# Altium schematic sheet RS485_RS232.SchDoc
size A4; SheetNumber: 2; SheetTotal: 5
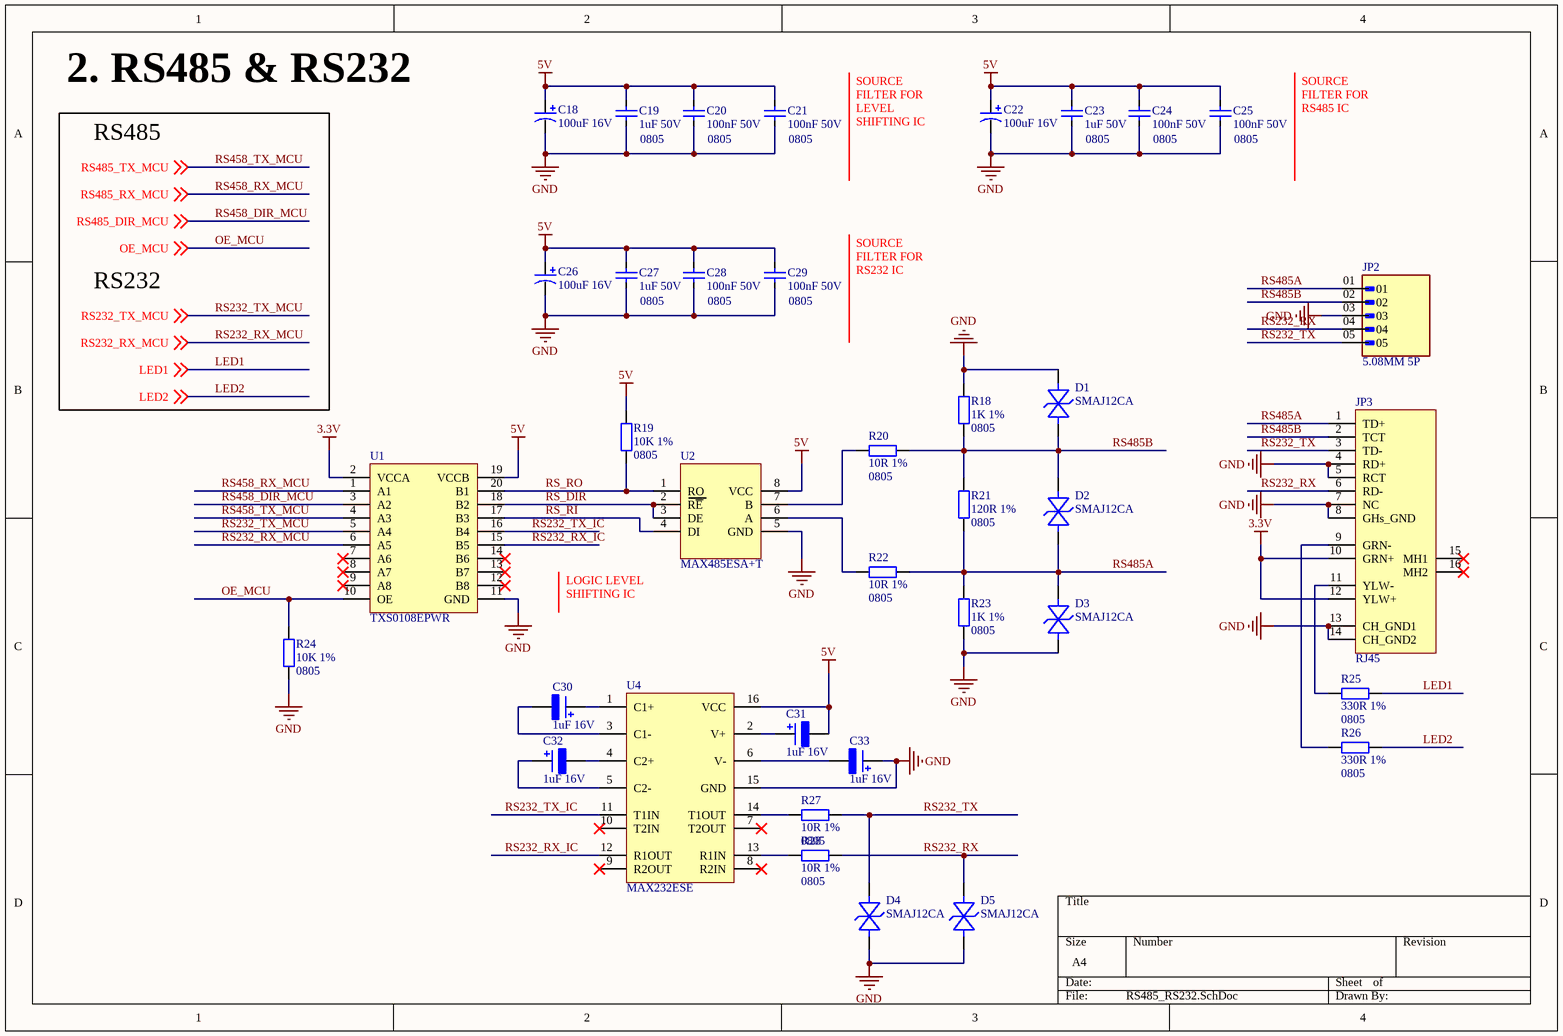
[diagram p0: RS485_RS232.SchDoc]

## Parts
C18  100uF 16V  [CAP-ALU-SMD-D]
C19  1uF 50V  Size: 0805  [CAP_SMD_0805]
C20  100nF 50V  Size: 0805  [CAP_SMD_0805]
C21  100nF 50V  Size: 0805  [CAP_SMD_0805]
C22  100uF 16V  [CAP-ALU-SMD-D]
C23  1uF 50V  Size: 0805  [CAP_SMD_0805]
C24  100nF 50V  Size: 0805  [CAP_SMD_0805]
C25  100nF 50V  Size: 0805  [CAP_SMD_0805]
C26  100uF 16V  [CAP-ALU-SMD-D]
C27  1uF 50V  Size: 0805  [CAP_SMD_0805]
C28  100nF 50V  Size: 0805  [CAP_SMD_0805]
C29  100nF 50V  Size: 0805  [CAP_SMD_0805]
C30  1uF 16V  [TANTALUM_3216]
C31  1uF 16V  [TANTALUM_3216]
C32  1uF 16V  [TANTALUM_3216]
C33  1uF 16V  [TANTALUM_3216]
D1  SMAJ12CA  [SMA]
D2  SMAJ12CA  [SMA]
D3  SMAJ12CA  [SMA]
D4  SMAJ12CA  [SMA]
D5  SMAJ12CA  [SMA]
JP2  5.08MM 5P  [5.08MM 5P]
JP3  RJ45  [RJ 45]
R18  1K 1%  Size: 0805  [RES_SMD_0805]
R19  10K 1%  Size: 0805  [RES_SMD_0805]
R20  10R 1%  Size: 0805  [RES_SMD_0805]
R21  120R 1%  Size: 0805  [RES_SMD_0805]
R22  10R 1%  Size: 0805  [RES_SMD_0805]
R23  1K 1%  Size: 0805  [RES_SMD_0805]
R24  10K 1%  Size: 0805  [RES_SMD_0805]
R25  330R 1%  Size: 0805  [RES_SMD_0805]
R26  330R 1%  Size: 0805  [RES_SMD_0805]
R27  10R 1%  Size: 0805  [RES_SMD_0805]
R28  10R 1%  Size: 0805  [RES_SMD_0805]
U1  TXS0108EPWR  [20-TSSOP]
U2  MAX485ESA+T  [SOIC-8]
U4  MAX232ESE  [SOP-16]

## Nets
3.3V: JP3.10(GRN+) JP3.12(YLW+) U1.2(VCCA)
5V: C18.1 C19.1 C20.2 C21.2 C22.1 C23.1 C24.2 C25.2 C26.1 C27.1 C28.2 C29.2 C31.2 R19.2 U1.19(VCCB) U2.8(VCC) U4.16(VCC)
GND: C18.2 C19.2 C20.1 C21.1 C22.2 C23.2 C24.1 C25.1 C26.2 C27.2 C28.1 C29.1 C33.1 D1.A D3.C D4.C D5.C JP2.03 JP3.4(RD+) JP3.5(RCT) JP3.7(NC) JP3.8(GHs_GND) JP3.13(CH_GND1) JP3.14(CH_GND2) R18.2 R23.1 R24.1 U1.11(GND) U2.5(GND) U4.15(GND)
LED1: R25.2 ; off-sheet LED1
LED2: R26.2 ; off-sheet LED2
OE_MCU: R24.2 U1.10(OE) ; off-sheet OE_MCU
RS232_RX: D5.A JP2.04 JP3.6(RD-) R28.2
RS232_RX_IC: U1.15(B5) U4.12(R1OUT)
RS232_RX_MCU: U1.6(A5) ; off-sheet RS232_RX_MCU
RS232_TX: D4.A JP2.05 JP3.3(TD-) R27.2
RS232_TX_IC: U1.16(B4) U4.11(T1IN)
RS232_TX_MCU: U1.5(A4) ; off-sheet RS232_TX_MCU
RS458_DIR_MCU: U1.3(A2) ; off-sheet RS485_DIR_MCU  [also labelled RS485_DIR_MCU]
RS458_RX_MCU: U1.1(A1) ; off-sheet RS485_RX_MCU  [also labelled RS485_RX_MCU]
RS458_TX_MCU: U1.4(A3) ; off-sheet RS485_TX_MCU  [also labelled RS485_TX_MCU]
RS485A: D2.C D3.A JP2.01 JP3.1(TD+) R21.1 R22.2 R23.2
RS485B: D1.C D2.A JP2.02 JP3.2(TCT) R18.1 R20.2 R21.2
RS_DIR: U1.18(B2) U2.2(R~{E}) U2.3(DE)
RS_RI: U1.17(B3) U2.4(DI)
RS_RO: R19.1 U1.20(B1) U2.1(RO)
NetC30_1: C30.1 U4.1(C1+)
NetC30_2: C30.2 U4.3(C1-)
NetC31_1: C31.1 U4.2(V+)
NetC32_1: C32.1 U4.5(C2-)
NetC32_2: C32.2 U4.4(C2+)
NetC33_2: C33.2 U4.6(V-)
NetJP3_9: JP3.9(GRN-) R26.1
NetJP3_11: JP3.11(YLW-) R25.1
NetR20_1: R20.1 U2.7(B)
NetR22_1: R22.1 U2.6(A)
NetR27_1: R27.1 U4.14(T1OUT)
NetR28_1: R28.1 U4.13(R1IN)

Not connected (* = marked no-connect by the designer): JP3 15(MH1)* 16(MH2)*; U1 7(A6)* 8(A7)* 9(A8)* 12(B8)* 13(B7)* 14(B6)*; U4 7(T2OUT)* 8(R2IN)* 9(R2OUT)* 10(T2IN)*

## Notes on the sheet
- 2. RS485 & RS232
- RS485
- SOURCE FILTER FOR LEVEL SHIFTING IC
- SOURCE FILTER FOR RS485 IC
- RS232
- SOURCE FILTER FOR RS232 IC
- (near U2) LOGIC LEVEL SHIFTING IC

## Library data of the parts
C18 C22 C26 = C_ALU_100uF_16V: 100uF 16V 63mA@120Hz ±20% SMD,D6.3xL5.4mm Aluminum Electrolytic Capacitors - SMD ROHS; Manufacturer: DMBJ; Manufacture Part Number: RVT1C101M0605 100UF 16V; Link: https://www.lcsc.com/product-detail/Aluminum-Electrolytic-Capacitors-SMD_DMBJ-RVT1C101M0605-100UF-16V_C970684.html; Price: $1.37
C19 C23 C27 = C0805_MLCC_1uF_50V: 1 µF ±10% 50V Ceramic Capacitor X7R 0805 (2012 Metric); Manufacturer: Samsung Electro-Mechanics; Manufacture Part Number: CL21B105KBFNNNG; Packaging: Cut Tape (CT); Link: https://www.digikey.cn/en/products/detail/samsung-electro-mechanics/CL21B105KBFNNNG/3894467; Price: $0.11
C20 C21 C24 C25 C28 C29 = C0805_MLCC_100nF_50V: 0.1 µF ±10% 50V Ceramic Capacitor X7R 0805 (2012 Metric); Manufacturer: YAGEO; Manufacture Part Number: CC0805KRX7R9BB104; Packaging: Cut Tape (CT); Link: https://www.digikey.cn/en/products/detail/yageo/CC0805KRX7R9BB104/302874; Price: $0.10
C30-C33 = C3216_TAN_1uF_16V: 10 µF Molded Tantalum Capacitors 16 V 1210 (3528 Metric) 2.8Ohm; Manufacturer: KEMET; Manufacture Part Number: T491A105K016AT; Capacitance: 1 µF; Tolerance: ±10%; Packaging: Cut Tape; Link: https://www.digikey.cn/en/products/detail/kemet/T491A105K016AT/818539; Price: $0.45; Voltage - Rated: 16 V; Operating Temperature: -55°C ~ 125°C
D1-D5 = TVS_20V_SMAJ12CA: 19.9V Clamp 20.1A Ipp Tvs Diode Surface Mount DO-214AC (SMA); Manufacturer: Littelfuse Inc.; Voltage - Reverse Standoff (Typ): 12V; Voltage - Breakdown (Min): 13.3V; Manufacture Part Number: SMAJ12CA; Packaging: Cut Tape (CT); Link: https://www.digikey.cn/en/products/detail/littelfuse-inc/SMAJ12CA/762271; Price: SMAJ12CA; Voltage - Clamping (Max) @ Ipp: 19.9V
JP2 = TERMINAL_5.08MM_5P: 5 Position Terminal Block Header, Male Pins, Shrouded (2 Side) 0.200" (5.08mm) 90°, Right Angle Through Hole; Manufacturer: Phoenix Contact; Manufacture Part Number: 1759046; Packaging: Bulk; Link: https://www.digikey.cn/en/products/detail/phoenix-contact/1759046/260466; Price: $1.61
JP3 = RJ45: 1 Port RJ45Through Hole 10/100 Base-T, AutoMDIX; Manufacturer: WIZnet; Manufacture Part Number: 1278-1052-ND; Packaging: Bulk; Link: https://www.digikey.com/en/products/detail/wiznet/j1b1211ccd/7604176; Price: $3.83
R18 R23 = R0805_1K: 1 kOhms ±1% 0.125W, 1/8W Chip Resistor 0805 (2012 Metric) Moisture Resistant Thick Film; Manufacturer: YAGEO; Manufacture Part Number: 311-1.00KCRCT-ND; Packaging: Cut Tape (CT); Link: https://www.digikey.com/en/products/detail/yageo/RC0805FR-071KL/727444; Price: $0.10
R19 R24 = R0805_10K: 10 kOhms ±1% 0.125W, 1/8W Chip Resistor 0805 (2012 Metric) Moisture Resistant Thick Film; Manufacturer: YAGEO; Manufacture Part Number: RC0805FR-0710KL; Packaging: Cut Tape (CT); Price: $0.10; Link: https://www.digikey.cn/en/products/detail/yageo/RC0805FR-0710KL/727535
R20 R22 R27 R28 = R0805_10R: 10 Ohms ±1% 0.125W, 1/8W Chip Resistor 0805 (2012 Metric) Moisture Resistant Thick Film; Manufacturer: YAGEO; Manufacture Part Number: RC0805FR-0710RL; Packaging: Cut Tape (CT); Link: https://www.digikey.com/en/products/detail/yageo/RC0805FR-0710RL/727534; Price: $0.10
R21 = R0805_120R: 120 Ohms ±1% 0.125W, 1/8W Chip Resistor 0805 (2012 Metric) Automotive AEC-Q200 Thick Film; Manufacturer: Stackpole Electronics Inc; Manufacture Part Number: RMCF0805FT120R; Packaging: Cut Tape (CT); Link: https://www.digikey.cn/en/products/detail/stackpole-electronics-inc/RMCF0805FT120R/1712658; Price: $0.10
R25 R26 = R0805_330R: 330 Ohms ±1% 0.125W, 1/8W Chip Resistor 0805 (2012 Metric) Automotive AEC-Q200 Thick Film; Manufacturer: Stackpole Electronics Inc; Manufacture Part Number: RMCF0805FT330R; Packaging: Cut Tape (CT); Link: https://www.digikey.cn/en/products/detail/stackpole-electronics-inc/RMCF0805FT330R/1760484; Price: $0.10
U1 = TXS0108EPWR: Voltage Level Translator Bidirectional 1 Circuit 8 Channel 60Mbps 20-TSSOP; Manufacturer: Texas Instruments; Manufacture Part Number: TXS0108EPWR; Packaging: Cut Tape; Link: https://www.digikey.cn/en/products/detail/texas-instruments/TXS0108EPWR/1775302; Price: $1.60
U2 = MAX485ESA+T: RS-422/RS-485 Interface IC Low-Power, Slew-Rate-Limited RS-485/RS-4; Manufacturer: Analog Devices / Maxim Integrated; Manufacture Part Number: MAX485ESA+T; Link: https://www.mouser.vn/ProductDetail/Analog-Devices-Maxim-Integrated/MAX485ESA%2bT?qs=LHmEVA8xxfYXmvxEk%252BFtEg%3D%3D; Price: $4.66
U4 = MAX232ESE: 2/2 Transceiver Full RS232 16-SOP; Manufacturer: UMW; Manufacture Part Number: MAX232ESE; Packaging: Cut Tape; Link: https://www.digikey.cn/en/products/detail/umw/max232ese/16705942; Price: $3.00